# EAGLE design magic (EAGLE 9.5.2)

## Sheet 1 of 2
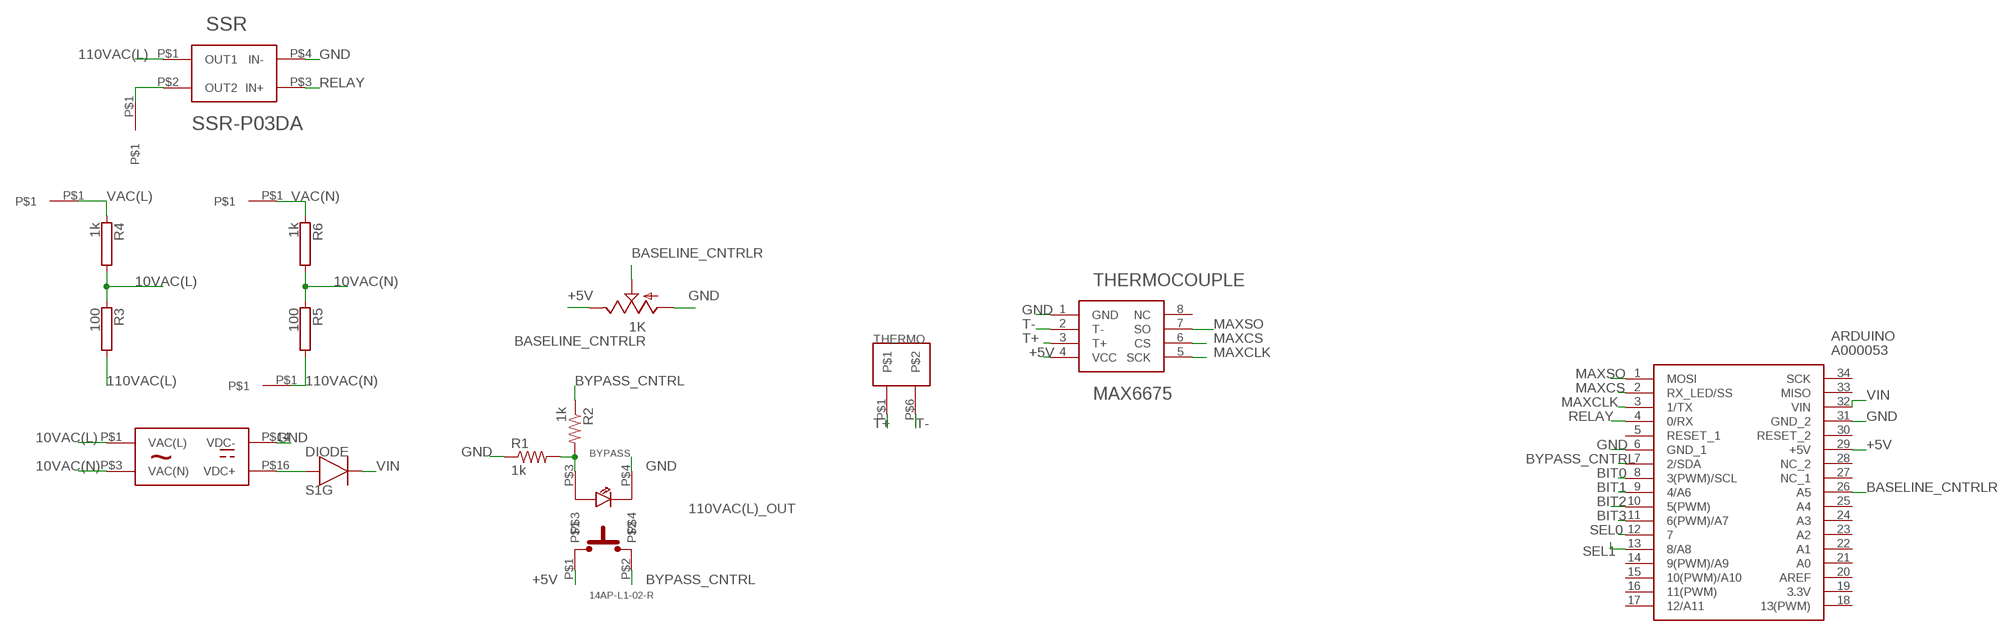
[diagram p0: schematic, sheet 1]

### Parts
110VAC(L)_OUT  6-GAUGE  [6-GAUGE]
110VAC(N)_OUT  6-GAUGE  [6-GAUGE]
AC(L)_IN  6-GAUGE  [6-GAUGE]
AC(N)_IN  6-GAUGE  [6-GAUGE]
ARDUINO  A000053  [HDRV34W70P1570X254_2X17_4900X1]
BASELINE_CNTRLR  1K  TRIM_US-PT10  [PT-10]
BYPASS  14AP-L1-02-R  [14XX-LX-0X-X]
DIODE  S1G  [S1G]
R1  1k  R-US_M1206  [M1206]
R2  1k  R-US_M1206  [M1206]
R3  100  RMG100-V  [TO-247-2V]
R4  1k  RMG100-V  [TO-247-2V]
R5  100  RMG100-V  [TO-247-2V]
R6  1k  RMG100-V  [TO-247-2V]
SSR  SSR-P03DA  [SSR-P03DA]
THERMO  PC6-16/2-G1-10,16  [PC6-16/2-G1-10,16]
THERMOCOUPLE  MAX6675  [MAX6675]
TRANSFORMER  RAC04-09SC  [RAC04-09SC]

### Nets
10VAC(L): R3.1 R4.2 TRANSFORMER.P$1(VAC(L))
10VAC(N): R5.1 R6.2 TRANSFORMER.P$3(VAC(N))
110VAC(L): R3.2 SSR.P$1(OUT1)
110VAC(L)_OUT: 110VAC(L)_OUT.P$1 SSR.P$2(OUT2)
110VAC(N): 110VAC(N)_OUT.P$1 R5.2
+5V: ARDUINO.29(+5V) BASELINE_CNTRLR.E BYPASS.P$1 THERMOCOUPLE.4(VCC) ; also sheet 2
BASELINE_CNTRLR: ARDUINO.26(A5) BASELINE_CNTRLR.S
BIT0: ARDUINO.8(3(PWM)/SCL) ; also sheet 2
BIT1: ARDUINO.9(4/A6) ; also sheet 2
BIT2: ARDUINO.10(5(PWM)) ; also sheet 2
BIT3: ARDUINO.11(6(PWM)/A7) ; also sheet 2
BYPASS_CNTRL: ARDUINO.7(2/SDA) BYPASS.P$2 R2.1
GND: ARDUINO.6(GND_1) ARDUINO.31(GND_2) BASELINE_CNTRLR.A BYPASS.P$4 R1.1 SSR.P$4(IN-) THERMOCOUPLE.1(GND) TRANSFORMER.P$14(VDC-) ; also sheet 2
MAXCLK: ARDUINO.3(1/TX) THERMOCOUPLE.5(SCK)
MAXCS: ARDUINO.2(RX_LED/SS) THERMOCOUPLE.6(CS)
MAXSO: ARDUINO.1(MOSI) THERMOCOUPLE.7(SO)
N$1: DIODE.2 TRANSFORMER.P$16(VDC+)
N$2: BYPASS.P$3 R1.2 R2.2
RELAY: ARDUINO.4(0/RX) SSR.P$3(IN+)
SEL0: ARDUINO.12 ; also sheet 2
SEL1: ARDUINO.13(8/A8) ; also sheet 2
T+: THERMO.P$1 THERMOCOUPLE.3(T+)
T-: THERMO.P$6 THERMOCOUPLE.2(T-)
VAC(L): AC(L)_IN.P$1 R4.1
VAC(N): AC(N)_IN.P$1 R6.1
VIN: ARDUINO.32(VIN) DIODE.1
Unconnected: ARDUINO.5(RESET_1) ARDUINO.14(9(PWM)/A9) ARDUINO.15(10(PWM)/A10) ARDUINO.16(11(PWM)) ARDUINO.17(12/A11) ARDUINO.18(13(PWM)) ARDUINO.19(3.3V) ARDUINO.20(AREF) ARDUINO.21(A0) ARDUINO.22(A1) ARDUINO.23(A2) ARDUINO.24(A3) ARDUINO.25(A4) ARDUINO.27(NC_1) ARDUINO.28(NC_2) ARDUINO.30(RESET_2) ARDUINO.33(MISO) ARDUINO.34(SCK) THERMOCOUPLE.8(NC)

## Sheet 2 of 2
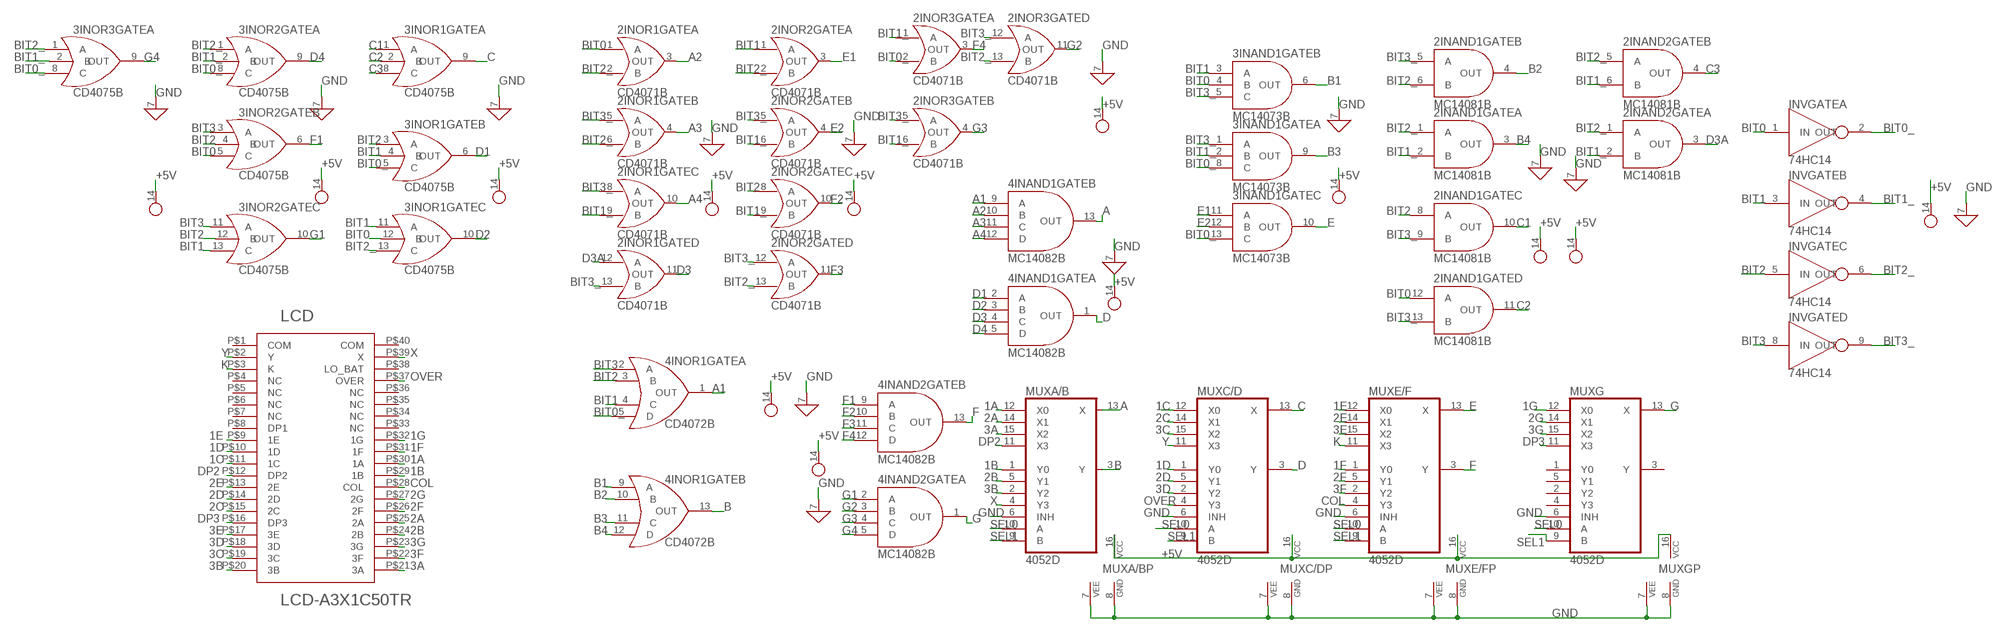
[diagram p1: schematic, sheet 2]

### Parts
2INAND1  MC14081B  [MC140XXBG]
2INAND2  MC14081B  [MC140XXBG]
2INOR1  CD4071B  [CD407XB]
2INOR2  CD4071B  [CD407XB]
2INOR3  CD4071B  [CD407XB]
3INAND1  MC14073B  [MC140XXBG]
3INOR1  CD4075B  [CD407XB]
3INOR2  CD4075B  [CD407XB]
3INOR3  CD4075B  [CD407XB]
4INAND1  MC14082B  [MC140XXBG]
4INAND2  MC14082B  [MC140XXBG]
4INOR1  CD4072B  [CD407XB]
INV  74HC14  [74HC14]
LCD  LCD-A3X1C50TR  [LCD-A3X1C50TR]
MUXA/B  4052D  [SO16]
MUXC/D  4052D  [SO16]
MUXE/F  4052D  [SO16]
MUXG  4052D  [SO16]

### Nets
1A: LCD.P$30(1A) MUXA/B.12(X0)
1B: LCD.P$29(1B) MUXA/B.1(Y0)
1C: LCD.P$11(1C) MUXC/D.12(X0)
1D: LCD.P$10(1D) MUXC/D.1(Y0)
1E: LCD.P$9(1E) MUXE/F.12(X0)
1F: LCD.P$31(1F) MUXE/F.1(Y0)
1G: LCD.P$32(1G) MUXG.12(X0)
2A: LCD.P$25(2A) MUXA/B.14(X1)
2B: LCD.P$24(2B) MUXA/B.5(Y1)
2C: LCD.P$15(2C) MUXC/D.14(X1)
2D: LCD.P$14(2D) MUXC/D.5(Y1)
2E: LCD.P$13(2E) MUXE/F.14(X1)
2F: LCD.P$26(2F) MUXE/F.5(Y1)
2G: LCD.P$27(2G) MUXG.14(X1)
3A: LCD.P$21(3A) MUXA/B.15(X2)
3B: LCD.P$20(3B) MUXA/B.2(Y2)
3C: LCD.P$19(3C) MUXC/D.15(X2)
3D: LCD.P$18(3D) MUXC/D.2(Y2)
3E: LCD.P$17(3E) MUXE/F.15(X2)
3F: LCD.P$22(3F) MUXE/F.2(Y2)
3G: LCD.P$23(3G) MUXG.15(X2)
+5V: 2INAND1.14 2INAND2.14 2INOR1.14 2INOR2.14 2INOR3.14 3INAND1.14 3INOR1.14 3INOR2.14 3INOR3.14 4INAND1.14 4INAND2.14 4INOR1.14 INV.14 MUXA/B.16(VCC) MUXC/D.16(VCC) MUXE/F.16(VCC) MUXG.16(VCC) ; also sheet 1
A: 4INAND1.13(GATEB:OUT) MUXA/B.13(X)
A1: 4INAND1.9(GATEB:A) 4INOR1.1(GATEA:OUT)
A2: 2INOR1.3(GATEA:OUT) 4INAND1.10(GATEB:B)
A3: 2INOR1.4(GATEB:OUT) 4INAND1.11(GATEB:C)
A4: 2INOR1.10(GATEC:OUT) 4INAND1.12(GATEB:D)
B: 4INOR1.13(GATEB:OUT) MUXA/B.3(Y)
B1: 3INAND1.6(GATEB:OUT) 4INOR1.9(GATEB:A)
B2: 2INAND1.4(GATEB:OUT) 4INOR1.10(GATEB:B)
B3: 3INAND1.9(GATEA:OUT) 4INOR1.11(GATEB:C)
B4: 2INAND1.3(GATEA:OUT) 4INOR1.12(GATEB:D)
BIT0: 2INAND1.12(GATED:A) 2INOR1.1(GATEA:A) 3INAND1.4(GATEB:B) 3INOR1.12(GATEC:B) 3INOR2.5(GATEB:C) INV.1(IN) ; also sheet 1
BIT0_: 2INOR3.2(GATEA:B) 3INAND1.8(GATEA:C) 3INAND1.13(GATEC:C) 3INOR1.5(GATEB:C) 3INOR2.8(GATEA:C) 3INOR3.8(GATEA:C) 4INOR1.5(GATEA:D) INV.2(OUT)
BIT1: 2INOR2.1(GATEA:A) 3INAND1.3(GATEB:A) 3INOR1.4(GATEB:B) 3INOR1.11(GATEC:A) 3INOR2.13(GATEC:C) 4INOR1.4(GATEA:C) INV.3(IN) ; also sheet 1
BIT1_: 2INAND1.2(GATEA:B) 2INAND2.2(GATEA:B) 2INAND2.6(GATEB:B) 2INOR1.9(GATEC:B) 2INOR2.6(GATEB:B) 2INOR2.9(GATEC:B) 2INOR3.1(GATEA:A) 2INOR3.6(GATEB:B) 3INAND1.2(GATEA:B) 3INOR2.2(GATEA:B) 3INOR3.2(GATEA:B) INV.4(OUT)
BIT2: 2INAND1.8(GATEC:A) 2INOR2.8(GATEC:A) 3INOR1.3(GATEB:A) 3INOR2.4(GATEB:B) 3INOR2.12(GATEC:B) 4INOR1.3(GATEA:B) INV.5(IN) ; also sheet 1
BIT2_: 2INAND1.1(GATEA:A) 2INAND1.6(GATEB:B) 2INAND2.1(GATEA:A) 2INAND2.5(GATEB:A) 2INOR1.2(GATEA:B) 2INOR1.6(GATEB:B) 2INOR2.2(GATEA:B) 2INOR2.13(GATED:B) 2INOR3.13(GATED:B) 3INOR1.13(GATEC:C) 3INOR2.1(GATEA:A) 3INOR3.1(GATEA:A) INV.6(OUT)
BIT3: 3INOR2.3(GATEB:A) 3INOR2.11(GATEC:A) 4INOR1.2(GATEA:A) INV.8(IN) ; also sheet 1
BIT3_: 2INAND1.5(GATEB:A) 2INAND1.9(GATEC:B) 2INAND1.13(GATED:B) 2INOR1.5(GATEB:A) 2INOR1.8(GATEC:A) 2INOR1.13(GATED:B) 2INOR2.5(GATEB:A) 2INOR2.12(GATED:A) 2INOR3.5(GATEB:A) 2INOR3.12(GATED:A) 3INAND1.1(GATEA:A) 3INAND1.5(GATEB:C) INV.9(OUT)
C: 3INOR1.9(GATEA:OUT) MUXC/D.13(X)
C1: 2INAND1.10(GATEC:OUT) 3INOR1.1(GATEA:A)
C2: 2INAND1.11(GATED:OUT) 3INOR1.2(GATEA:B)
C3: 2INAND2.4(GATEB:OUT) 3INOR1.8(GATEA:C)
COL: LCD.P$28(COL) MUXE/F.4(Y3)
D: 4INAND1.1(GATEA:OUT) MUXC/D.3(Y)
D1: 3INOR1.6(GATEB:OUT) 4INAND1.2(GATEA:A)
D2: 3INOR1.10(GATEC:OUT) 4INAND1.3(GATEA:B)
D3: 2INOR1.11(GATED:OUT) 4INAND1.4(GATEA:C)
D3A: 2INAND2.3(GATEA:OUT) 2INOR1.12(GATED:A)
D4: 3INOR2.9(GATEA:OUT) 4INAND1.5(GATEA:D)
DP2: LCD.P$12(DP2) MUXA/B.11(X3)
DP3: LCD.P$16(DP3) MUXG.11(X3)
E: 3INAND1.10(GATEC:OUT) MUXE/F.13(X)
E1: 2INOR2.3(GATEA:OUT) 3INAND1.11(GATEC:A)
E2: 2INOR2.4(GATEB:OUT) 3INAND1.12(GATEC:B)
F: 4INAND2.13(GATEB:OUT) MUXE/F.3(Y)
F1: 3INOR2.6(GATEB:OUT) 4INAND2.9(GATEB:A)
F2: 2INOR2.10(GATEC:OUT) 4INAND2.10(GATEB:B)
F3: 2INOR2.11(GATED:OUT) 4INAND2.11(GATEB:C)
F4: 2INOR3.3(GATEA:OUT) 4INAND2.12(GATEB:D)
G: 4INAND2.1(GATEA:OUT) MUXG.13(X)
G1: 3INOR2.10(GATEC:OUT) 4INAND2.2(GATEA:A)
G2: 2INOR3.11(GATED:OUT) 4INAND2.3(GATEA:B)
G3: 2INOR3.4(GATEB:OUT) 4INAND2.4(GATEA:C)
G4: 3INOR3.9(GATEA:OUT) 4INAND2.5(GATEA:D)
GND: 2INAND1.7 2INAND2.7 2INOR1.7 2INOR2.7 2INOR3.7 3INAND1.7 3INOR1.7 3INOR2.7 3INOR3.7 4INAND1.7 4INAND2.7 4INOR1.7 INV.7 MUXA/B.6(INH) MUXA/B.7(VEE) MUXA/B.8(GND) MUXC/D.6(INH) MUXC/D.7(VEE) MUXC/D.8(GND) MUXE/F.6(INH) MUXE/F.7(VEE) MUXE/F.8(GND) MUXG.6(INH) MUXG.7(VEE) MUXG.8(GND) ; also sheet 1
K: LCD.P$3(K) MUXE/F.11(X3)
OVER: LCD.P$37(OVER) MUXC/D.4(Y3)
SEL0: MUXA/B.10(A) MUXC/D.10(A) MUXE/F.10(A) MUXG.10(A) ; also sheet 1
SEL1: MUXA/B.9(B) MUXC/D.9(B) MUXE/F.9(B) MUXG.9(B) ; also sheet 1
X: LCD.P$39(X) MUXA/B.4(Y3)
Y: LCD.P$2(Y) MUXC/D.11(X3)
Unconnected: 2INAND2.8(GATEC:A) 2INAND2.9(GATEC:B) 2INAND2.10(GATEC:OUT) 2INAND2.11(GATED:OUT) 2INAND2.12(GATED:A) 2INAND2.13(GATED:B) 2INOR3.8(GATEC:A) 2INOR3.9(GATEC:B) 2INOR3.10(GATEC:OUT) 3INOR3.3(GATEB:A) 3INOR3.4(GATEB:B) 3INOR3.5(GATEB:C) 3INOR3.6(GATEB:OUT) 3INOR3.10(GATEC:OUT) 3INOR3.11(GATEC:A) 3INOR3.12(GATEC:B) 3INOR3.13(GATEC:C) INV.10(IN) INV.11(OUT) INV.12(IN) INV.13(OUT) LCD.P$1(COM) LCD.P$4(NC) LCD.P$5(NC) LCD.P$6(NC) LCD.P$7(NC) LCD.P$8(DP1) LCD.P$33(NC) LCD.P$34(NC) LCD.P$35(NC) LCD.P$36(NC) LCD.P$38(LO_BAT) LCD.P$40(COM) MUXG.1(Y0) MUXG.2(Y2) MUXG.3(Y) MUXG.4(Y3) MUXG.5(Y1)

## Library data of the parts
2INAND1 2INAND2 = magic:MC14081B
2INOR1-2INOR3 = magic:CD4071B
3INAND1 = magic:MC14073B
3INOR1-3INOR3 = magic:CD4075B
4INAND1 4INAND2 = magic:MC14082B
4INOR1 = magic:CD4072B
110VAC(L)_OUT 110VAC(N)_OUT AC(L)_IN AC(N)_IN = magic:6-GAUGE
ARDUINO = A000053:A000053: Arduino Micro Arduino Micro Source: Datasheet <http://uk.rs-online.com/web/p/products/7717667>; DESCRIPTION: Arduino Micro Arduino Micro; HEIGHT: 16mm; MANUFACTURER_NAME: Arduino; MANUFACTURER_PART_NUMBER: A000053; MOUSER_PART_NUMBER: 782-A000053; MOUSER_PRICE-STOCK: https://www.mouser.com/Search/Refine.aspx?Keyword=782-A000053; RS_PART_NUMBER: 7717667; RS_PRICE-STOCK: http://uk.rs-online.com/web/p/products/7717667
BASELINE_CNTRLR = pot:TRIM_US-: POTENTIOMETER
BYPASS = magic:14AP-L1-02-R
DIODE = magic:S1G
INV = magic:74HC14
LCD = magic:LCD-A3X1C50TR
MUXA/B MUXC/D MUXE/F MUXG = 40xx:4052: Dual 4-channel ANALOG MULTIPLEXER
R1 R2 = rcl:R-US_: RESISTOR, American symbol; SPICEPREFIX: R
R3-R6 = resistor-power:RMG100: TO-247 Power Resistor - RMG 100 Series Source: www.token.com.tw .. power-resistor-rmg100pdf; OC_FARNELL: unknown; OC_NEWARK: unknown
SSR = magic:SSR-P03DA
THERMO = magic:PC6-16/2-G1-10,16
THERMOCOUPLE = magic:MAX6675
TRANSFORMER = magic:RAC04-09SC

## Board
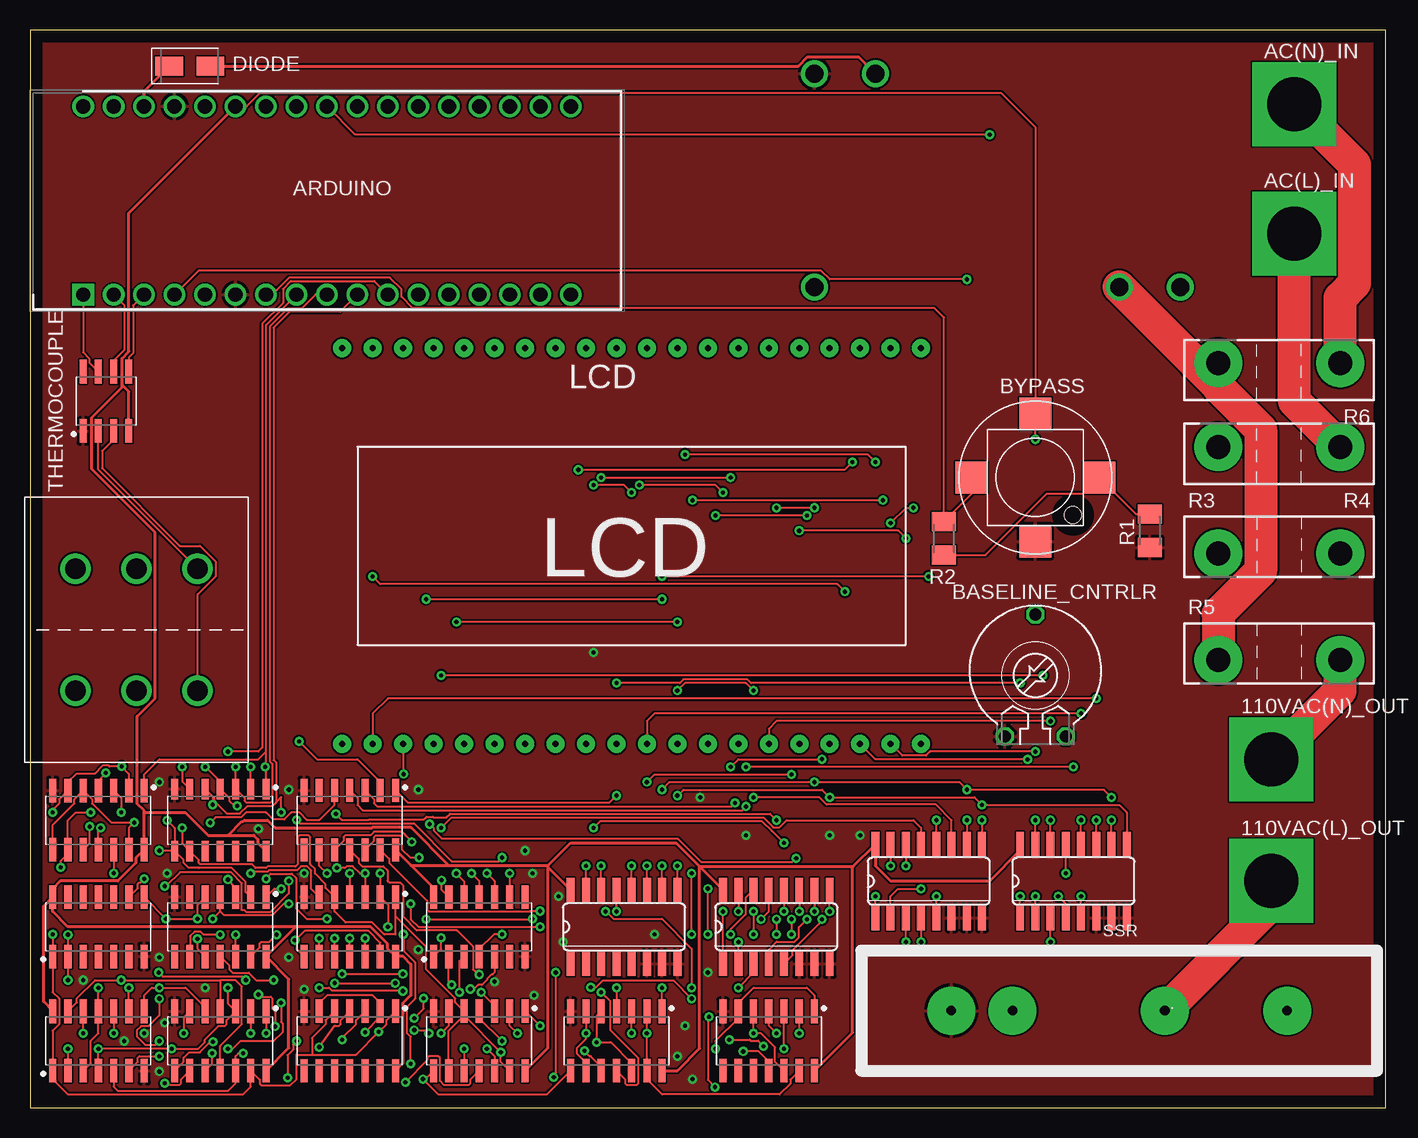
[diagram p2: board, top side]
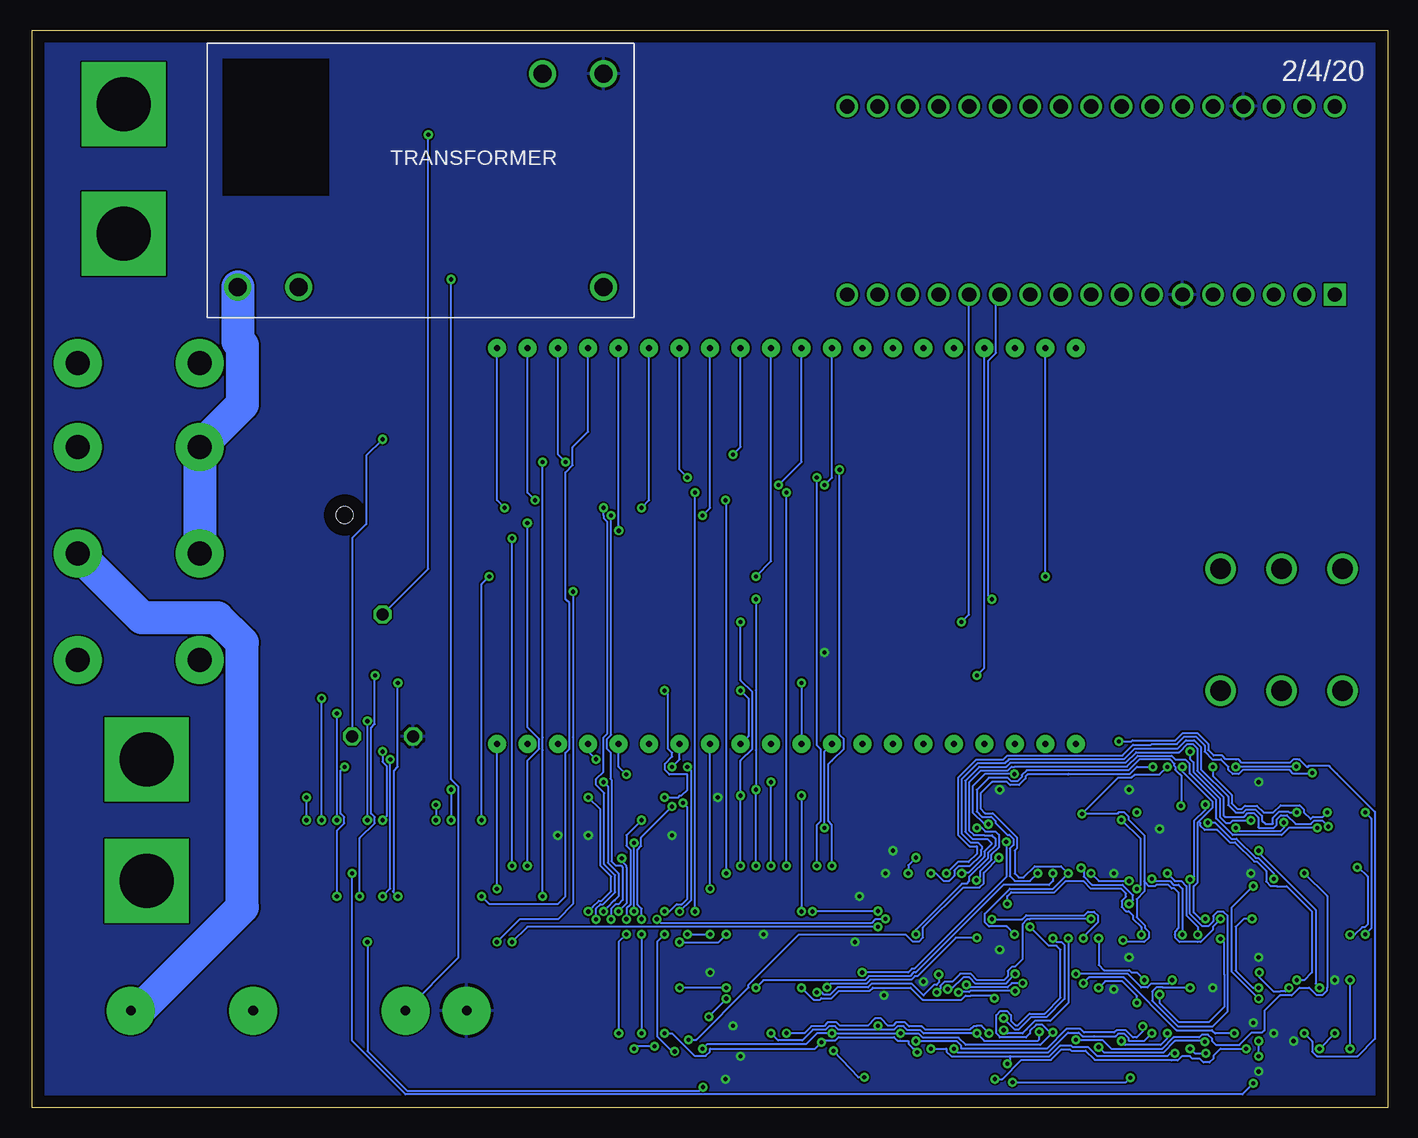
[diagram p3: board, bottom side, seen from below]

Size 113.01 x 89.84 mm. Coordinates in mm from the lower left corner, seen from the top.
Outline: 0,0 113.01,0 113.01,89.84 0,89.84 0,0
Copper layers (1*16): Top 0.035mm / dielectric 1.5mm / Bottom 0.035mm
Design rules "default *": minimum track width 6mil, minimum drill 0.35mm, track to track 6mil, track to pad 6mil, pad to pad 6mil, via to via 6mil, smd to smd 6mil, copper to edge 40mil, drill to drill 6mil, minimum pad ring 10mil, minimum via ring 8mil, stop-mask expansion 4mil, vias tented up to drill 0mil, thermal gap 10mil

### Footprints (pad centres in the part's own frame; a part is rotated, then mirrored left to right if it is on the bottom)
MC140XXBG = smd 1.952 x 0.589: 1 -2.482,3.81; 2 -2.482,2.54; 3 -2.482,1.27; 4 -2.482,0; 5 -2.482,-1.27; 6 -2.482,-2.54; 7 -2.482,-3.81; 8 2.482,-3.81; 9 2.482,-2.54; 10 2.482,-1.27; 11 2.482,0; 12 2.482,1.27; 13 2.482,2.54; 14 2.482,3.81
CD407XB = smd 1.968 x 0.599: 1 -2.473,3.81; 2 -2.473,2.54; 3 -2.473,1.27; 4 -2.473,0; 5 -2.473,-1.27; 6 -2.473,-2.54; 7 -2.473,-3.81; 8 2.473,-3.81; 9 2.473,-2.54; 10 2.473,-1.27; 11 2.473,0; 12 2.473,1.27; 13 2.473,2.54; 14 2.473,3.81
6-GAUGE = drill 4.5 pad 7 square: P$1 0,0
HDRV34W70P1570X254_2X17_4900X1 = drill 1.2 pad 1.8 square: 1 0,0 | drill 1.2 pad 1.8: 2 2.54,0; 3 5.08,0; 4 7.62,0; 5 10.16,0; 6 12.7,0; 7 15.24,0; 8 17.78,0; 9 20.32,0; 10 22.86,0; 11 25.4,0; 12 27.94,0; 13 30.48,0; 14 33.02,0; 15 35.56,0; 16 38.1,0; 17 40.64,0; 18 40.64,15.7; 19 38.1,15.7; 20 35.56,15.7; 21 33.02,15.7; 22 30.48,15.7; 23 27.94,15.7; 24 25.4,15.7; 25 22.86,15.7; 26 20.32,15.7; 27 17.78,15.7; 28 15.24,15.7; 29 12.7,15.7; 30 10.16,15.7; 31 7.62,15.7; 32 5.08,15.7; 33 2.54,15.7; 34 0,15.7
PT-10 = drill 1.016 octagon: A -2.54,-5.08; E 2.54,-5.08; S 0,5.08
14XX-LX-0X-X = smd 2.67 x 2.67: P$1 0,5.325; P$2 -5.325,0; P$3 5.325,0; P$4 0,-5.325 | hole 1.4: 3.147,-3.147
S1G = smd 2.31 x 1.564: 1 -1.724,0; 2 1.724,0
74HC14 = smd 1.746 x 0.592: 1 -2.585,3.81; 2 -2.585,2.54; 3 -2.585,1.27; 4 -2.585,0; 5 -2.585,-1.27; 6 -2.585,-2.54; 7 -2.585,-3.81; 8 2.585,-3.81; 9 2.585,-2.54; 10 2.585,-1.27; 11 2.585,0; 12 2.585,1.27; 13 2.585,2.54; 14 2.585,3.81
LCD-A3X1C50TR = drill 0.5 pad 1.5: P$1 -24.13,-16.5; P$2 -21.59,-16.5; P$3 -19.05,-16.5; P$4 -16.51,-16.5; P$5 -13.97,-16.5; P$6 -11.43,-16.5; P$7 -8.89,-16.5; P$8 -6.35,-16.5; P$9 -3.81,-16.5; P$10 -1.27,-16.5; P$11 1.27,-16.5; P$12 3.81,-16.5; P$13 6.35,-16.5; P$14 8.89,-16.5; P$15 11.43,-16.5; P$16 13.97,-16.5; P$17 16.51,-16.5; P$18 19.05,-16.5; P$19 21.59,-16.5; P$20 24.13,-16.5; P$21 24.13,16.5; P$22 21.59,16.5; P$23 19.05,16.5; P$24 16.51,16.5; P$25 13.97,16.5; P$26 11.43,16.5; P$27 8.89,16.5; P$28 6.35,16.5; P$29 3.81,16.5; P$30 1.27,16.5; P$31 -1.27,16.5; P$32 -3.81,16.5; P$33 -6.35,16.5; P$34 -8.89,16.5; P$35 -11.43,16.5; P$36 -13.97,16.5; P$37 -16.51,16.5; P$38 -19.05,16.5; P$39 -21.59,16.5; P$40 -24.13,16.5
SO16 = smd 0.66 x 2.032: 1 -4.445,-3.073; 2 -3.175,-3.073; 3 -1.905,-3.073; 4 -0.635,-3.073; 5 0.635,-3.073; 6 1.905,-3.073; 7 3.175,-3.073; 8 4.445,-3.073; 9 4.445,3.073; 10 3.175,3.073; 11 1.905,3.073; 12 0.635,3.073; 13 -0.635,3.073; 14 -1.905,3.073; 15 -3.175,3.073; 16 -4.445,3.073
M1206 = smd 1.6 x 2: 1 -1.4,0; 2 1.4,0
TO-247-2V = drill 2 pad 4: 1 -5.08,0; 2 5.08,0
SSR-P03DA = drill 0.8 pad 4: P$1 10.2,0; P$2 0,0; P$3 -12.7,0; P$4 -17.8,0
PC6-16/2-G1-10,16 = drill 1.7: P$1 0,0; P$2 0,5.08; P$3 0,10.16; P$4 10.16,10.16; P$5 10.16,5.08; P$6 10.16,0
MAX6675 = smd 1.968 x 0.589: 1 -2.473,1.905; 2 -2.473,0.635; 3 -2.473,-0.635; 4 -2.473,-1.905; 5 2.473,-1.905; 6 2.473,-0.635; 7 2.473,0.635; 8 2.473,1.905
RAC04-09SC = drill 1.5: P$1 0,0; P$3 5.08,0; P$13 30.48,0; P$14 30.48,17.78; P$16 25.4,17.78

### Placement (x,y rotation side)
2INAND1  37.45,5.55 270 top
2INAND2  26.66,5.55 270 top
2INOR1  5.7,23.96 270 top
2INOR2  48.88,5.55 270 top
2INOR3  61.59,5.55 270 top
3INAND1  26.66,15.08 270 top
3INOR1  15.87,5.55 270 top
3INOR2  5.7,5.55 90 top
3INOR3  5.7,15.08 90 top
4INAND1  37.45,15.08 90 top
4INAND2  26.66,23.96 270 top
4INOR1  15.87,15.08 270 top
110VAC(L)_OUT  103.5,18.89 0 top
110VAC(N)_OUT  103.5,29.05 0 top
AC(L)_IN  105.4,72.86 0 top
AC(N)_IN  105.4,83.66 0 top
ARDUINO  4.44,67.78 0 top
BASELINE_CNTRLR  83.81,36.03 0 top
BYPASS  83.81,52.54 0 top
DIODE  13.33,86.83 0 top
INV  15.87,23.96 270 top
LCD  50.16,46.83 0 top
MUXA/B  74.92,18.89 0 top
MUXC/D  86.98,18.89 0 top
MUXE/F  62.22,15.08 0 top
MUXG  49.52,15.08 0 top
R1  93.34,48.09 90 top
R2  76.19,47.46 270 top
R3  104.13,46.19 0 top
R4  104.13,55.08 180 top
R5  104.13,37.3 0 top
R6  104.13,62.06 180 top
SSR  94.6,8.09 0 top
THERMO  13.96,34.76 90 top
THERMOCOUPLE  6.34,58.89 90 top
TRANSFORMER  95.88,68.41 0 bottom

### Tracks (layer width: path | path; a pad name or v marks a point on that pad's centre or on a via)
1A  (via drill 0.35)
  Top 0.152: MUXA/B.12 v75.56,23.96 | v74.92,44.29 v52.7,44.29
  Bottom 0.152: v75.56,23.96 75.56,43.65 v74.92,44.29 | LCD.P$30 51.42,45.55 v52.7,44.29
1B  (via drill 0.35)
  Top 0.152: MUXA/B.1 v70.47,17.62 | v70.47,53.81 69.84,54.45 v54.6,54.45
  Bottom 0.152: v70.47,17.62 70.47,29.78 70.46,29.79 70.46,30.86 70.47,30.87 v70.47,53.81 | v54.6,54.45 53.97,55.08 LCD.P$29
1C  (via drill 0.35)
  Top 0.152: MUXC/D.12 v87.62,23.96 | v87.62,32.86 52.06,32.86 51.42,32.22 LCD.P$11
  Bottom 0.152: v87.62,23.96 v87.62,32.86
1D  (via drill 0.35)
  Top 0.152: MUXC/D.1 v82.54,17.62 | v82.54,35.4 60.11,35.4 59.81,35.7 54.47,35.7 54.17,35.4 v48.88,35.4
  Bottom 0.152: v48.88,35.4 LCD.P$10 | v82.54,17.62 82.96,18.03 82.86,18.13 82.86,28.09 82.54,28.41 v82.54,35.4
1E  (via drill 0.35)
  Top 0.152: MUXE/F.12 v62.86,16.36 | v62.86,22.06 61.86,23.05 61.84,23.05 61.02,23.88 47.53,23.88 v46.98,23.33
  Bottom 0.152: v62.86,16.36 v62.86,22.06 | v46.98,23.33 46.98,29.69 LCD.P$9
1F  (via drill 0.35)
  Top 0.152: MUXE/F.1 v57.77,16.35 | v57.77,51.27 57.13,51.91 v50.8,51.91
  Bottom 0.152: v57.77,16.35 v57.77,51.27 | v50.8,51.91 48.88,53.83 LCD.P$31
1G  (via drill 0.35)
  Top 0.152: MUXG.12 v50.16,20.16 | v50.16,51.27 49.52,51.91 v46.98,51.91 v46.97,51.9
  Bottom 0.152: v50.16,20.16 v50.16,51.27 | v46.97,51.9 46.34,52.52 LCD.P$32
2A  (via drill 0.35)
  Top 0.152: MUXA/B.14 v73.02,20.16 | v73.02,47.46 72.38,48.09 v64.12,48.09
  Bottom 0.152: v73.02,20.16 v73.02,47.46 | v64.12,48.09 LCD.P$25
2B  (via drill 0.35)
  Top 0.152: MUXA/B.5 v75.56,17.62
  Bottom 0.152: v75.56,17.62 74.92,16.98 69.2,16.98 68.57,17.62 68.57,29.58 68.23,29.92 68.23,30.73 68.24,30.74 68.24,42.05 68.57,42.38 68.57,52.95 67.96,53.56 67.96,55.05 66.66,56.35 LCD.P$24
2C  (via drill 0.35)
  Top 0.152: MUXC/D.14 v85.08,23.96 | v85.08,32.22 62.22,32.22 61.59,31.59 LCD.P$15
  Bottom 0.152: v85.08,23.96 v85.08,32.22
2D  (via drill 0.35)
  Top 0.152: MUXC/D.5 v87.62,17.62 | v86.98,28.41 v59.68,28.41
  Bottom 0.152: v87.62,17.62 87.62,23.11 87.01,23.71 87.01,24.22 87.31,24.52 87.31,28.08 v86.98,28.41 | v59.68,28.41 59.05,29.05 LCD.P$14
2E  (via drill 0.35)
  Top 0.152: MUXE/F.14 59.65,17.48 59.65,16.09 58.41,14.85 v58.41,14.44 | v56.51,14.44 v56.51,18.25
  Bottom 0.152: v58.41,14.44 v56.51,14.44 | v56.51,18.25 LCD.P$13
2F  (via drill 0.35)
  Top 0.152: MUXE/F.5 63.57,12.71 63.57,13.11 66.03,15.58 v66.03,15.7 | v65.4,50.01 v65.39,50 v62.22,50
  Bottom 0.152: v62.22,50 61.59,50.63 LCD.P$26 | v66.03,15.7 66,15.72 66,16.6 65.65,16.95 65.42,16.95 64.43,17.95 64.43,19.38 65.34,20.29 65.34,26.23 66,26.89 66,27.39 65.39,28 65.39,29.78 65.41,29.79 65.41,30.86 65.06,31.2 65.06,48.81 65.37,49.11 65.37,49.34 65.4,49.37 v65.4,50.01
2G  (via drill 0.35)
  Top 0.152: MUXG.14 v47.62,20.16 | v47.62,52.54 v58.41,52.54
  Bottom 0.152: v58.41,52.54 59.05,53.17 LCD.P$27 | v47.62,20.16 47.59,20.18 47.59,23.58 47.28,23.88 47.28,29.88 47.59,30.18 47.59,52.51 v47.62,52.54
3A  (via drill 0.35)
  Top 0.152: MUXA/B.15 v71.75,20.16 | v71.75,48.73 73.02,50 v73.65,50
  Bottom 0.152: v71.75,20.16 71.75,28.94 70.77,29.92 70.77,30.73 71.75,31.71 v71.75,48.73 | v73.65,50 74.28,50.63 LCD.P$21
3B  (via drill 0.35)
  Top 0.152: MUXA/B.2 71.75,17.62 72.36,18.23 v74.28,18.23
  Bottom 0.152: v74.28,18.23 LCD.P$20
3C  (via drill 0.35)
  Top 0.152: MUXC/D.15 v83.81,23.96 | v83.81,29.68 75.02,29.68 74.69,29.35 72.72,29.35 LCD.P$19
  Bottom 0.152: v83.81,29.68 83.81,28.82 83.47,28.48 83.47,24.3 v83.81,23.96
3D  (via drill 0.35)
  Top 0.152: MUXC/D.2 v83.81,17.62 | v83.17,29.04 70.49,29.04 LCD.P$18
  Bottom 0.152: v83.81,17.62 83.17,18.26 v83.17,29.04
3E  (via drill 0.35)
  Top 0.152: MUXE/F.15 v59.05,16.35 | v58.41,28.41 59.05,29.05 v66.03,29.05
  Bottom 0.152: v66.03,29.05 66.66,29.68 LCD.P$17 | v59.05,16.35 58.08,17.31 58.08,28.08 v58.41,28.41
3F  (via drill 0.35)
  Top 0.152: MUXE/F.2 v59.05,13.79 v59.05,13.8 | v55.16,14.44 v55.16,19.52 | v55.23,50.63 v71.11,50.63
  Bottom 0.152: v59.05,13.8 55.8,13.8 v55.16,14.44 | v55.16,19.52 55.16,50.56 v55.23,50.63 | v71.11,50.63 71.75,51.27 LCD.P$22
3G  (via drill 0.35)
  Top 0.152: MUXG.15 v46.34,20.16 | v45.71,53.17 67.94,53.17 v68.57,53.81
  Bottom 0.152: v45.71,53.17 45.71,31.07 45.37,30.73 45.37,29.92 46.29,28.99 46.34,28.94 46.67,28.61 46.67,23.88 46.37,23.58 46.37,20.18 v46.34,20.16 | v68.57,53.81 69.2,54.45 LCD.P$23
10VAC(L)
  Bottom 2.769: TRANSFORMER.P$1 95.88,63.89 95.51,63.53 95.51,58.62 R4.2 R3.1
10VAC(N)
  Top 2.769: TRANSFORMER.P$3 97.15,62.06 | 97.15,62.06 R6.2 99.05,60.16 | R5.1 99.05,41.19 102.59,44.73 102.59,56.55 99.05,60.08 99.05,60.16 | 97.15,62.06 99.05,60.16
110VAC(L)
  Bottom 2.769: SSR.P$1 104.13,8.09 95.51,16.71 95.51,38.77 97.59,40.84 103.86,40.84 R3.2
110VAC(L)_OUT
  Top 2.769: SSR.P$2 103.5,16.98 110VAC(L)_OUT.P$1
110VAC(N)
  Top 2.769: 110VAC(N)_OUT.P$1 109.21,34.76 R5.2
+5V  (via drill 0.35)
  Top 0.152: ARDUINO.29 18.08,83.48 19.21,84.61 80.95,84.61 83.81,81.75 BYPASS.P$1 v83.81,55.72
  Top 0.254: ARDUINO.29 8.24,74.59 8.24,63.04 7.67,62.46 7.67,60.26 7.69,60.24 | THERMOCOUPLE.4 8.24,59.69 7.69,60.24 | 9.52,24.6 2INOR1.14 8.82,20.8 8.82,20.39 7.32,18.89 2.53,18.89 1.9,18.25 3INOR3.14 | 9.52,24.6 9.52,24.76 8.94,25.34 8.94,32.62 10.43,34.12 10.43,47.94 5.13,53.25 5.13,57.52 7.69,60.08 7.69,60.24 | INV.14 18.98,22.07 18.98,22.37 18.65,22.7 16.5,22.7 | 9.52,24.6 12.94,24.6 14.84,22.7 16.5,22.7 | 4INAND2.14 31.77,20.18 | 31.77,20.18 33.64,18.31 4INAND1.14 | 22.15,15.08 28.38,15.08 29.77,13.69 29.77,13.29 3INAND1.14 31.11,12.59 31.74,11.96 31.74,9.36 31.08,8.7 31.08,3.67 2INAND2.14 | 22.15,15.08 3.16,15.08 1.9,16.35 3INOR3.14 | 31.77,20.18 34.91,20.18 | 34.91,20.18 43.04,20.18 | 43.04,20.18 MUXG.16 | 43.04,20.18 43.17,20.18 | 55.82,20.1 MUXE/F.16 | 55.82,20.1 68.57,20.1 | 68.57,20.1 68.62,20.1 MUXA/B.16 70.47,20.16 71.75,18.89 80,18.89 82.54,21.43 MUXC/D.16 | 2INOR3.14 68.57,6.25 68.57,20.1 | 2INOR2.14 53.97,3.08 55.82,4.93 55.82,20.1 | 2INAND1.14 43.17,4.97 43.17,20.18 | 3INOR1.14 21.58,4.98 21.58,10.7 4INOR1.14 22.15,15.08 | 3INOR2.14 1.9,8.09 1.14,8.84 1.14,16.8 3INOR3.14 | 34.91,20.18 31.75,23.35 28.54,23.35 28.52,23.33 20.44,23.33 19.81,23.96 17.88,23.96 17.76,23.85 17.65,23.85 16.5,22.7 | 43.17,20.18 43.2,20.18 45.08,22.06 53.86,22.06 55.82,20.1
  Bottom 0.152: BASELINE_CNTRLR.E 86.35,47.47 85.16,48.65 85.16,54.36 v83.81,55.72
A  (via drill 0.35)
  Top 0.152: 4INAND1.13 34.31,18.16 v34.31,18.96 | MUXA/B.13 74.28,23.33 73.65,23.96 63.08,23.96 62.47,23.36 61.97,23.36 61.14,24.18 35.13,24.18 v34.28,23.33
  Bottom 0.152: v34.31,18.96 34.28,18.94 34.01,19.22 34.01,19.7 33.04,20.67 33.04,21.09 32.43,21.7 32.43,22.75 32.71,23.03 33.56,23.03 33.87,23.33 v34.28,23.33
A1  (via drill 0.35)
  Top 0.152: 4INOR1.1 20.37,18.24 v20.94,18.24 | v39.99,19.52 4INAND1.9 | v22.21,23.99 22.52,23.69 28.37,23.69 28.39,23.7 32,23.7 35.16,20.54 39.06,20.54 v39.36,20.84
  Bottom 0.152: v39.36,20.84 39.99,20.21 v39.99,19.52 | v22.21,23.99 20.61,22.39 20.61,18.57 v20.94,18.24
A2  (via drill 0.35)
  Top 0.152: 2INOR1.3 7.61,25.8 v7.61,24.6 | v38.09,19.52 38.73,18.89 4INAND1.10
  Bottom 0.152: v38.09,19.52 37.68,19.52 37.07,18.91 36.57,18.91 36.15,19.34 36.15,19.76 35.79,20.12 34.88,20.12 33.95,21.05 33.95,21.47 33.82,21.6 33.82,21.76 34.15,22.09 34.76,22.09 35.54,22.87 35.54,27.37 34.2,28.72 31.94,28.72 31.62,29.04 22.01,29.04 21.12,29.93 17.54,29.93 16.85,30.62 16.15,30.62 15.59,30.06 15.59,28.2 13.33,25.94 13.33,25.23 12.69,24.6 12.05,24.6 11.8,24.85 11.04,24.85 10.51,24.32 10.51,23.96 10.18,23.64 9.64,23.64 9.59,23.69 9.59,24.14 9.06,24.68 8.3,24.68 8.23,24.6 v7.61,24.6
A3  (via drill 0.35)
  Top 0.152: 2INOR1.4 5.7,27.2 v6.31,27.9 | v36.82,19.52 37.45,18.89 4INAND1.11
  Bottom 0.152: v6.31,27.9 6.34,27.83 7.89,27.83 8.2,28.14 12.1,28.14 12.44,27.8 12.94,27.8 13.3,28.16 13.3,28.41 13.93,29.05 14.65,29.05 15.28,29.68 15.28,30.18 16.02,30.93 16.98,30.93 17.59,30.32 19.68,30.32 19.75,30.24 21.25,30.24 22.14,29.35 31.74,29.35 32.07,29.02 34.33,29.02 35.85,27.5 35.85,22.75 34.88,21.78 34.28,21.78 34.28,21.15 34.96,20.47 35.87,20.47 v36.82,19.52
A4  (via drill 0.35)
  Top 0.152: 2INOR1.10 4.97,22.03 v4.97,23.43 | v35.54,19.51 36.19,18.87 4INAND1.12
  Bottom 0.152: v4.97,23.43 5.48,23.94 6.13,23.94 6.43,23.64 7.69,23.64 8.43,24.37 8.93,24.37 9.28,24.02 9.28,23.56 9.52,23.33 10.78,23.33 10.81,23.36 10.81,24.19 11.17,24.55 11.67,24.55 11.98,24.24 13.6,24.24 13.71,24.35 13.71,25.89 15.89,28.07 15.89,29.93 16.28,30.32 16.72,30.32 17.41,29.63 21,29.63 21.88,28.74 31.49,28.74 31.81,28.41 34.07,28.41 35.24,27.25 35.24,23 34.63,22.39 33.37,22.39 33.04,22.06 33.04,21.95 33.65,21.35 33.65,20.92 34.98,19.59 35.46,19.59 v35.54,19.51
B  (via drill 0.35)
  Top 0.152: v20.56,14.42 19.96,13.81 19.28,13.81 19.15,13.68 19.15,13.34 4INOR1.13 | v31.74,16.98 31.74,15.71 32.38,15.08 v42.51,15.08 | v73.02,13.8 MUXA/B.3
  Bottom 0.152: v20.56,14.42 20.56,15.05 21.25,15.74 21.25,16.02 21.61,16.37 21.83,16.37 22.19,16.73 22.19,17.23 21.83,17.59 21.83,17.85 22.23,18.25 24.77,18.25 25.41,18.89 26.86,18.89 27.8,17.95 31.41,17.95 31.74,17.62 v31.74,16.98 | v42.51,15.08 71.75,15.08 v73.02,13.8
B1  (via drill 0.35)
  Top 0.152: 3INAND1.6 23.46,18.22 23.46,19.27 23.46,19.77 23.1,20.13 22.6,20.13 22.27,19.8 19.93,19.8 19.81,19.67 18.55,19.67 v18.41,19.52 | v15.87,14.42 14.46,14.42 14.21,14.67 13.71,14.67 13.35,14.31 13.35,12.63 4INOR1.9
  Bottom 0.152: v18.41,19.52 17.77,18.89 17.23,18.89 16.8,18.46 16.8,16.02 15.87,15.08 v15.87,14.42
B2  (via drill 0.35)
  Top 0.152: v13.96,14.06 13.96,13.24 4INOR1.10 | v20.45,6.76 20.45,8.01 20.2,8.26 20.2,9.1 20.07,9.24 19.23,9.24 v19.04,9.42 | v39.36,5.55 37.45,7.45 2INAND1.4
  Bottom 0.152: v39.36,5.55 39.33,5.52 35.93,5.52 35.58,5.17 35.58,4.94 35.55,4.91 28.44,4.91 26.8,6.56 25.65,6.56 25.35,6.26 22.82,6.26 22.61,6.46 21.86,6.46 21.25,5.86 20.95,5.86 20.45,6.35 v20.45,6.76 | v19.04,9.42 19.04,8.73 17.44,7.12 14.92,7.12 13.66,8.39 13.66,11.1 13.66,11.27 13.66,13.76 v13.96,14.06
B3  (via drill 0.35)
  Top 0.152: 4INOR1.11 16.61,11.86 16.61,11.52 16.89,11.24 18.24,11.24 18.85,10.63 v20.31,10.63 | 3INAND1.9 v24.12,14.11
  Bottom 0.152: v20.31,10.63 20.95,11.27 21.37,11.27 21.57,11.46 23.68,11.46 24.12,11.9 v24.12,14.11
B4  (via drill 0.35)
  Top 0.152: 4INOR1.12 v17.14,14.42 | v24.75,15.73 23.08,15.73 22.19,16.63 22.19,19.14 21.83,19.49 20.06,19.49 19.68,19.11 v19.68,19.06 | v37.62,9.61 38.73,8.5 2INAND1.3
  Bottom 0.152: v37.62,9.61 37.31,9.91 37.31,10.13 36.96,10.49 36.33,10.49 35.66,11.16 34.78,11.16 34.25,10.63 32.02,10.63 31.69,10.96 31.69,11.39 31.33,11.74 31.11,11.74 30.47,12.38 30.47,15.3 30.09,15.68 29.89,15.68 29.84,15.73 v24.75,15.73 | v19.68,19.06 19.5,18.89 18.2,18.89 17.9,18.58 17.46,18.58 17.14,18.25 v17.14,14.42
BASELINE_CNTRLR  (via drill 0.35)
  Top 0.152: v80,81.12 27.12,81.12 ARDUINO.26
  Bottom 0.152: BASELINE_CNTRLR.S 80,44.92 v80,81.12
BIT0  (via drill 0.35)
  Top 0.152: 2INOR1.1 9.52,27.78 10.78,29.05 19.04,29.05 19.68,29.68 | INV.1 19.68,28.41 | 19.68,28.41 19.68,29.68 | 19.68,29.68 19.68,65.24 ARDUINO.8 | 3INOR2.5 6.98,1.74 7.3,1.41 16.5,1.41 17.14,2.05 3INOR1.12 17.14,4.28 17.39,4.53 v17.77,4.53 | 19.68,28.41 v19.59,28.41 | v26.66,19.52 3INAND1.4 | v38.09,4.91 38.73,4.28 2INAND1.12 | v31.13,14.44 31.13,13.07 32.1,12.11 32.1,9.08 31.43,8.42 31.43,6.21 31.73,5.91 v31.73,3.65
  Bottom 0.152: 31.49,4.28 36.41,4.28 36.79,4.66 36.79,4.89 36.82,4.91 v38.09,4.91 | 31.49,4.28 28.21,4.28 27.35,5.15 26.38,5.15 26.28,5.04 24.98,5.04 24.22,4.28 18.41,4.28 18.15,4.53 v17.77,4.53 | v19.59,28.41 20.92,28.41 21.5,27.82 26.61,27.82 26.66,27.78 30.04,27.78 30.22,27.59 30.22,27.43 30.76,26.89 31.51,26.89 31.76,27.14 33.01,27.14 33.98,26.18 33.98,24.93 33.59,24.54 32.94,24.54 30.91,22.53 30.91,21.62 31.11,21.43 31.11,19.52 30.77,19.19 30.39,19.19 29.45,20.13 27.27,20.13 v26.66,19.52 27.93,18.25 31.54,18.25 33.62,16.17 33.62,15.46 33.26,15.1 31.77,15.1 31.13,14.46 v31.13,14.44 | v31.73,3.65 31.49,3.9 31.49,4.28
BIT0_  (via drill 0.35)
  Top 0.152: 3INOR2.8 9.52,9.36 10.15,9.99 v10.78,9.99 12.96,9.99 14.59,8.36 3INOR1.5 | INV.2 v18.41,28.41 | 4INOR1.5 13.96,16.91 v13.96,15.73 v11.33,15.73 3INOR3.8 | 3INAND1.8 22.21,13.23 22.21,13.8 v22.09,13.93 22.88,14.72 28.24,14.72 29.2,13.76 3INAND1.13 | v62.22,23.96 61.7,24.49 35.01,24.49 34.7,24.18 33.62,24.18 33.56,24.24 33.06,24.24 32.83,24.01 28.26,24.01 28.25,23.99 26,23.99 v25.5,24.49 | v63.49,15.71 v63.49,14.44 | v64.12,6.19 2INOR3.2
  Bottom 0.152: 20.31,18.89 20.31,22.7 21.61,23.99 21.61,24.24 21.96,24.59 22.47,24.59 22.57,24.49 v25.5,24.49 22.47,27.52 21.38,27.52 21.12,27.78 19.04,27.78 v18.41,28.41 | v62.22,23.96 63.49,22.7 63.49,21.84 63.16,21.51 63.16,16.91 63.46,16.61 63.46,15.74 v63.49,15.71 | v63.49,14.44 64.12,13.8 v64.12,6.19 | v11.33,15.73 12.03,15.73 12.69,15.08 12.69,11.42 11.26,9.99 v10.78,9.99 | v13.96,15.73 14.26,15.43 14.26,15.41 14.59,15.08 14.59,14.83 15.61,13.81 15.86,13.81 15.87,13.8 17.38,13.8 17.74,14.17 17.74,14.41 17.77,14.44 17.74,14.47 17.74,14.67 17.44,14.97 17.44,17.92 17.8,18.28 18.02,18.28 18.33,18.58 19.3,18.58 19.42,18.46 19.93,18.46 20.28,18.81 20.28,18.86 20.31,18.89 | 20.31,18.89 20.31,18.01 20.95,17.38 20.95,15.87 20.26,15.18 20.26,14.97 19.95,14.67 19.95,14.16 20.31,13.8 21.96,13.8 v22.09,13.93
BIT1  (via drill 0.35)
  Top 0.152: 3INOR2.13 3.91,8.77 3.91,9.1 5.44,10.63 v7.61,10.63 15.87,10.63 | 15.87,10.63 3INOR1.4 | 3INOR1.11 15.87,5.15 17.66,6.94 17.66,10.1 17.14,10.63 15.87,10.63 | v17.14,28.41 INV.3 17.88,25.8 17.88,25.58 18.02,25.45 20.07,25.45 20.2,25.58 20.2,28.66 19.98,28.88 19.98,65.11 21.52,66.65 22.68,66.65 23.81,67.78 ARDUINO.9 | v15.23,15.73 15.85,16.36 | 15.85,16.36 15.87,16.37 4INOR1.4 | 2INOR2.1 v52.7,9.99 | 3INAND1.3 v27.93,19.52 27.52,19.52 26.91,20.13 26.41,20.13 26.26,19.98 v25.58,19.98 | v21.58,16.98 21.14,16.98 20.2,16.03 16.18,16.03 15.85,16.36
  Bottom 0.152: v17.14,28.41 17.14,28.02 14.62,25.51 14.62,25.01 15.77,23.87 | 15.77,23.87 15.87,23.76 15.87,18.79 16.2,18.46 16.2,16.27 15.66,15.73 v15.23,15.73 | v52.7,9.99 52.06,10.63 43.6,10.63 43.27,10.96 39.87,10.96 39.56,11.27 39.36,11.27 32.07,18.55 28.26,18.55 27.93,18.89 v27.93,19.52 | v25.58,19.98 25.36,19.76 25.36,19.27 24.67,18.58 22.13,18.58 21.25,17.7 21.25,17.31 v21.58,16.98 | 15.77,23.87 15.62,23.73 15.62,23.5 15.27,23.15 14.23,23.15 13.19,22.11 12.76,22.11 11.16,20.51 10.94,20.51 10.15,19.72 10.15,18.84 9.77,18.46 9.52,18.46 9.26,18.46 8.45,18.46 6.34,16.35 6.34,11.27 6.98,10.63 v7.61,10.63
BIT1_  (via drill 0.35)
  Top 0.152: v5.07,24.6 3.8,24.6 3.16,23.96 2INOR1.9 3.16,21.17 2.56,20.57 v2.56,20.03 | v14.59,28.41 14.64,28.41 15.87,27.19 INV.4 16.61,25.8 16.61,25.58 17.05,25.15 v17.27,25.15 | v3.16,14.42 3INOR3.2 v3.16,10.63 | v3.16,4.91 3INOR2.2 | 2INOR2.6 v46.34,6.19 46.34,5.72 45.61,4.99 45.61,4.49 46.34,3.75 2INOR2.9 | v40.63,6.19 39.99,6.82 2INAND1.2 | v27.93,6.28 29.2,7.55 2INAND2.2 29.2,8.73 28.57,9.36 24.75,9.36 24.12,8.73 2INAND2.6 | v57.14,4.91 57.14,5.55 59.05,7.45 2INOR3.6 59.05,8.73 60.31,9.99 64.76,9.99 65.39,9.36 2INOR3.1 | v29.84,15.08 29.84,16.92 3INAND1.2 v29.2,19.52
  Bottom 0.152: v3.16,14.42 v3.15,14.43 2.76,14.43 2.15,15.05 1.92,15.05 1.7,15.27 1.7,19.26 2.47,20.03 v2.56,20.03 | v3.16,10.63 v3.16,4.91 | v57.14,4.91 56.76,5.3 48.5,5.3 47.62,6.19 v46.34,6.19 v40.63,6.19 40.6,6.16 39.11,6.16 38.78,5.83 35.81,5.83 35.2,5.22 28.99,5.22 v27.93,6.28 28.19,6.28 28.82,6.92 29.32,6.92 29.84,6.41 29.84,6.19 30.16,5.86 32.38,5.86 32.38,5.94 32.64,6.21 32.64,7.71 32.29,8.06 31.79,8.06 31.43,7.71 31.43,7.25 31.05,6.87 30.85,6.87 29.89,7.83 28.62,7.83 27.3,9.16 27.3,13.17 27.62,13.5 27.75,13.5 27.75,13.51 28.27,13.51 v29.84,15.08 | v17.27,25.15 17.23,25.19 17.23,27.68 17.35,27.8 17.39,27.8 17.74,28.16 17.74,28.41 17.8,28.47 17.8,28.66 18.15,29.02 20.74,29.02 21.63,28.13 30.12,28.13 30.53,27.72 30.53,27.55 30.88,27.2 31.39,27.2 31.69,27.5 33.29,27.5 34.28,26.51 34.28,24.68 33.84,24.24 33.06,24.24 32.71,23.88 32.71,23.72 31.74,22.75 31.58,22.75 31.22,22.4 31.22,21.9 31.52,21.59 31.52,19.3 31.11,18.89 29.84,18.89 v29.2,19.52 | v14.59,28.41 14.59,27.64 13.02,26.06 13.02,25.36 12.56,24.91 12.18,24.91 11.92,25.16 10.92,25.16 10.36,24.6 9.56,24.6 8.95,25.21 7.36,25.21 7,24.85 7,24.63 6.44,24.06 6.26,24.24 5.43,24.24 v5.07,24.6
BIT2  (via drill 0.35)
  Top 0.152: v15.23,25.26 15.23,25.91 INV.5 15.34,25.8 15.34,25.58 16.41,24.51 17.49,24.51 18.12,25.14 20.19,25.14 20.5,25.46 | 4INOR1.3 17.14,18.27 v16.5,19.01 | 20.5,25.46 20.95,25.9 v20.95,24.62 | 3INOR2.4 v5.7,4.91 v11.82,4.91 14.03,4.91 14.57,5.46 14.57,5.65 15.74,6.81 16.26,6.81 16.39,6.94 16.39,7.28 3INOR1.3 16.5,8.66 v16.5,9.99 | v4.44,6.19 3INOR2.12 | 2INOR2.8 43.09,1.09 34.04,1.09 v32.76,2.38 32.95,2.38 2INAND1.8 | ARDUINO.10 25.86,66.35 21.64,66.35 20.31,65.01 20.31,28.98 20.5,28.79 20.5,25.46
  Bottom 0.152: v5.7,4.91 v4.44,6.19 | 16.5,18.89 16.5,16.14 15.48,15.13 14.98,15.13 14.57,15.54 14.57,15.98 14.21,16.34 13.71,16.34 13.35,15.98 13.35,8.03 14.59,6.79 17.53,6.79 19.65,8.91 19.65,9.67 19.29,10.03 18.79,10.03 18.78,10.02 16.53,10.02 v16.5,9.99 | 16.5,18.89 v16.5,19.01 | v11.82,4.91 13.96,4.91 14.52,4.35 14.52,4.13 14.88,3.77 15.38,3.77 15.69,4.07 16.29,4.07 16.5,4.28 17.17,4.28 17.52,3.93 18.02,3.93 18.07,3.98 24.45,3.98 25.21,4.74 26.4,4.74 26.51,4.84 27.22,4.84 28.09,3.98 30.55,3.98 32.15,2.38 v32.76,2.38 | v15.23,25.26 15.23,24.83 16.17,23.89 16.17,19.21 16.5,18.89
BIT2_  (via drill 0.35)
  Top 0.152: v12.69,28.41 12.69,27.19 INV.6 | 2INOR1.2 8.24,27.84 v7.64,28.44 6.63,28.44 6.56,28.51 6.06,28.51 5.39,27.84 3.86,27.84 3.16,27.14 2INOR1.6 2.42,25.7 2.42,25.36 1.9,24.83 v1.9,24.6 | v1.9,14.44 3INOR3.1 1.9,9.63 2.42,9.1 2.42,6.94 1.9,6.42 3INOR2.1 1.9,2.38 3.16,1.11 17.77,1.11 18.41,1.74 3INOR1.13 19.15,2.34 19.15,2 19.28,1.86 21.7,1.86 22.21,2.38 22.21,4.41 23.48,4.41 | 2INAND2.5 24.64,7.29 24.64,6.93 23.51,5.8 23.51,4.44 23.48,4.41 | 2INAND2.1 29.72,7.29 29.72,6.96 v29.07,6.31 27.17,4.41 23.48,4.41 | 2INOR2.2 v51.42,6.19 2INOR2.13 51.42,2.38 52.7,1.11 62.49,1.11 63.38,2 63.38,2.34 2INOR3.13 | v42.51,6.82 41.3,8.03 2INAND1.1 | 2INAND1.6 34.91,6.84 34.61,6.53 34.61,6.52 v34.28,6.19
  Bottom 0.152: v7.64,28.44 12.66,28.44 v12.69,28.41 | v29.07,6.31 29.07,5.68 29.2,5.55 33.64,5.55 v34.28,6.19 38.71,6.19 38.98,6.46 40.05,6.46 40.38,6.79 40.88,6.79 41.18,6.49 42.18,6.49 | v51.42,6.19 50.84,5.6 48.83,5.6 47.94,6.49 46.9,6.49 46.6,6.79 46.09,6.79 45.79,6.49 42.18,6.49 | v1.9,24.6 1.4,24.1 1.4,14.94 v1.9,14.44 | 42.18,6.49 v42.51,6.82
BIT3  (via drill 0.35)
  Top 0.152: INV.8 12.8,20.63 12.8,20.41 13.19,20.02 14.03,20.02 14.08,19.97 16.83,19.97 17.97,18.83 17.97,17.98 4INOR1.2 | v16.5,29.68 19.04,29.68 19.37,30.01 19.37,65.37 21.09,67.08 21.09,68.25 21.75,68.91 28.71,68.91 ARDUINO.11 | v11.42,23.94 12.05,23.31 INV.8 | 3INOR2.3 5.07,3.71 5.07,5.55 5.7,6.19 3INOR2.11 v5.7,9.99 | v10.78,21.43 12.01,21.43 INV.8
  Bottom 0.152: v16.5,29.68 16.5,29.06 16.22,28.79 16.22,27.97 14.01,25.76 14.01,24.23 13.54,23.75 13.13,23.75 12.94,23.94 v11.43,23.94 v11.42,23.94 | v10.78,21.43 10.78,21.22 6.03,16.47 6.03,10.33 v5.7,9.99
BIT3_  (via drill 0.35)
  Top 0.152: 2INOR1.13 8.24,23.33 v8.68,23.76 6.77,23.76 5.18,25.36 5.18,25.7 2INOR1.5 3.69,25.7 3.69,25.36 1.9,23.56 2INOR1.8 | v12.69,23.33 12.69,22.02 INV.9 14.07,20.63 14.07,20.41 14.2,20.28 18.5,20.28 18.81,19.98 19.68,19.98 19.81,20.1 22.14,20.1 22.33,20.29 22.33,22.55 22.46,22.69 23.24,22.69 23.37,22.55 23.37,20.29 23.76,19.9 23.76,19.51 24.64,18.63 24.64,18.3 3INAND1.5 25.39,16.35 26.3,15.43 28.53,15.43 29.52,14.44 30.47,14.44 30.47,15.96 | 2INAND1.13 39.25,3.81 v39.25,4.62 36.19,7.68 | 36.19,7.68 2INAND1.5 35.44,8.78 35.44,9.1 33,11.54 33,13.42 30.47,15.96 | 2INAND1.9 34.91,6.41 36.19,7.68 | 30.47,15.96 3INAND1.1 | 2INOR2.5 47.23,7.64 v47.23,5.45 48.42,5.45 50.16,3.71 2INOR2.12 | 2INOR3.5 v60.31,6.19 60.94,6.19 62.11,5.01 62.11,3.82 2INOR3.12
  Bottom 0.152: v60.31,6.19 59.68,6.19 57.8,4.31 56.89,4.31 56.53,4.66 56.53,4.89 56.51,4.91 47.77,4.91 v47.23,5.45 47.1,5.58 46.09,5.58 46.04,5.63 45.79,5.88 41.18,5.88 40.88,5.58 40.66,5.58 40.63,5.55 39.99,5.55 39.97,5.52 39.97,5.3 39.61,4.94 39.58,4.94 v39.25,4.62 | v8.68,23.76 8.68,23.34 8.99,23.03 12.39,23.03 v12.69,23.33
BYPASS_CNTRL
  Top 0.152: BYPASS.P$2 78.48,51.16 R2.1 76.19,65.88 75.41,66.65 31.91,66.65 30.96,67.59 30.96,68.25 30,69.21 21.62,69.21 20.19,67.78 ARDUINO.7
C  (via drill 0.35)
  Top 0.152: 3INOR1.9 12.58,2.34 12.58,2 12.45,1.86 11.66,1.86 11.51,2.02 v11.23,2.02 | v86.35,19.52 MUXC/D.13
  Bottom 0.152: v11.23,2.02 12.14,1.11 81.91,1.11 86.35,5.55 v86.35,19.52
C1  (via drill 0.35)
  Top 0.152: 3INOR1.1 v19.68,6.19 | v36.19,4.91 2INAND1.10
  Bottom 0.152: v36.19,4.91 35.86,4.59 28.34,4.59 26.67,6.26 25.77,6.26 25.47,5.95 24.5,5.95 22.69,5.95 22.49,6.16 21.99,6.16 21.63,5.8 21.63,5.6 21.58,5.55 20.31,5.55 v19.68,6.19
C2  (via drill 0.35)
  Top 0.152: 3INOR1.2 v18.41,6.19 | v22.24,5.55 21.94,5.25 21.94,4.83 21.47,4.37 v21.47,2.49 | 2INAND1.11 36.71,2.32 36.71,2 36.57,1.86 34.53,1.86 34.17,2.22 34.17,4.14 34.03,4.27 33.26,4.27 33.12,4.14 33.12,3.95 v31.3,2.12
  Bottom 0.152: v21.47,2.49 21.83,2.12 v31.3,2.12 | v22.24,5.55 21.91,5.22 18.94,5.22 18.41,5.76 v18.41,6.19
C3  (via drill 0.35)
  Top 0.152: 3INOR1.8 12.8,3.82 12.8,4.16 13.25,4.61 14.15,4.61 15.02,5.47 v15.26,5.47 | v24.12,5.04 25.4,6.83 25.78,6.83 25.91,6.96 25.91,7.29 2INAND2.4
  Bottom 0.152: v24.12,5.04 23.66,4.59 18.72,4.59 17.75,5.55 15.33,5.55 v15.26,5.47
COL  (via drill 0.35)
  Top 0.152: MUXE/F.4 61.59,13.17 62.25,13.83 63.74,13.83 64.1,14.19 64.1,15.03 v64.76,15.7 | v64.76,49.37 v57.14,49.37
  Bottom 0.152: v64.76,49.37 64.76,31.07 65.1,30.73 65.1,29.92 64.81,29.63 64.81,27.41 64.73,27.34 64.73,20.54 64.38,20.18 63.95,20.18 63.8,20.03 63.8,17.31 64.15,16.96 64.38,16.96 64.76,16.58 v64.76,15.7 | v57.14,49.37 56.51,50 LCD.P$28
D  (via drill 0.35)
  Top 0.152: 4INAND1.1 34.28,13.23 v34.28,14.16 | v46.75,10.02 47.18,10.02 47.76,10.6 53.65,10.6 v55.16,9.09 | v56.62,7.57 56.51,7.45 56.51,2.31 v57.11,1.71 | v85.08,13.8 MUXC/D.3
  Bottom 0.152: v34.28,14.16 36.03,14.16 39.23,10.96 39.44,10.96 39.74,10.66 43.14,10.66 43.48,10.33 46.45,10.33 v46.75,10.02 | v55.16,9.09 56.62,7.63 v56.62,7.57 | v57.11,1.71 57.41,1.41 81.78,1.41 85.08,4.71 v85.08,13.8
D1  (via drill 0.35)
  Top 0.152: 3INOR1.6 12.82,7.52 v12.82,6.19 | v35.15,10.24 34.91,10.48 4INAND1.2 | v25.4,10.38 v30.45,10.38
  Bottom 0.152: v12.82,6.19 14.39,6.19 14.66,6.46 17.64,6.46 22.02,10.85 24.93,10.85 v25.4,10.38 | v30.45,10.38 31.36,10.38 31.71,10.02 34.93,10.02 v35.15,10.24
D2  (via drill 0.35)
  Top 0.152: v16.5,4.91 16.91,4.91 17.52,5.52 20.28,5.52 21.06,6.3 21.06,7.02 20.92,7.15 v20.92,8.73 | v24.12,9.99 24.93,9.99 25.15,9.77 31.03,9.77 v31.08,9.72 | v35.8,9.6 35.8,12.2 4INAND1.3 | v15.18,4.53 15.18,3.66 3INOR1.10
  Bottom 0.152: v31.08,9.72 34.82,9.72 34.9,9.64 35.76,9.64 v35.8,9.6 | v20.92,8.73 20.92,9.32 22.15,10.54 23.57,10.54 v24.12,9.99 | v16.5,4.91 16.12,4.53 v15.18,4.53
D3  (via drill 0.35)
  Top 0.152: 2INOR1.11 5.7,23.15 v5.88,23.33 | v39.36,14.44 38.67,14.44 37.45,13.23 4INAND1.4
  Bottom 0.152: v5.88,23.33 8.25,23.33 8.86,22.72 12.94,22.72 14.32,24.1 14.32,25.64 16.53,27.85 16.53,28.66 16.88,29.02 17.72,29.02 18.03,29.32 20.87,29.32 21.76,28.43 31.11,28.43 31.13,28.41 31.39,28.41 31.69,28.11 33.95,28.11 34.93,27.12 34.93,23.12 34.53,22.72 33.67,22.72 33.64,22.7 33.01,22.7 32.74,22.42 32.74,21.83 33.34,21.22 33.34,20.79 34.92,19.22 34.92,18.89 35.14,18.66 35.53,18.66 39.36,14.83 v39.36,14.44
D3A  (via drill 0.35)
  Top 0.152: 2INOR1.12 v6.98,19.54 | 2INAND2.3 27.18,7.29 27.18,6.96 26.02,5.8 v26.02,5.65
  Bottom 0.152: v6.98,19.54 5.07,17.64 5.07,9.99 5.1,9.97 5.1,9.74 5.46,9.38 5.47,9.39 5.96,9.39 6.56,9.99 7.39,9.99 8.02,9.36 9.01,9.36 10.3,8.06 10.3,6.44 10.48,6.26 11.34,6.26 12.38,5.22 14.33,5.22 14.65,5.54 14.65,5.73 15.01,6.08 15.51,6.08 15.73,5.86 17.88,5.86 18.82,4.91 23.07,4.91 23.81,5.65 24.37,5.65 v26.02,5.65
D4  (via drill 0.35)
  Top 0.152: 3INOR2.9 v8.24,9.98 v8.25,9.99 | v10.72,11.27 11.05,10.94 17.69,10.94 v17.99,10.63 | v26.02,11.14 v31.08,11.14 | 4INAND1.5 38.73,11.27 38.57,11.11 38.47,11.11 38.12,10.75 38.12,10.66 37.68,10.22 37.37,10.22 37.03,9.88 v36.71,9.88
  Bottom 0.152: v26.02,11.14 25.9,11.27 25.79,11.15 21.69,11.15 20.56,10.02 20.06,10.02 19.75,10.33 18.29,10.33 v17.99,10.63 | v31.08,11.14 31.74,10.48 31.74,10.43 31.84,10.33 34.38,10.33 34.9,10.85 35.41,10.85 36.37,9.88 v36.71,9.88 | v8.25,9.99 8.55,9.69 8.99,9.69 9.01,9.66 9.52,9.66 10.72,10.87 v10.72,11.27
DP2  (via drill 0.35)
  Top 0.152: MUXA/B.11 76.83,23.96 75.53,25.26 66.41,25.26 65.81,25.87 v60.31,25.87 | v60.31,34.76 59.68,35.4 54.6,35.4 v53.97,34.76
  Bottom 0.152: v53.97,34.76 53.33,34.12 53.33,30.96 LCD.P$12 | v60.31,34.76 60.02,34.47 60.02,29.92 59.68,29.58 59.68,29.27 60.29,28.66 60.29,28.16 59.9,27.78 58.41,27.78 58.41,26.51 58.91,26.01 59.02,26.01 59.16,25.87 v60.31,25.87
DP3  (via drill 0.35)
  Top 0.152: MUXG.11 v51.42,20.16 | v51.42,27.14 52.06,27.78 v63.49,27.78
  Bottom 0.152: v51.42,20.16 v51.42,27.14 | v63.49,27.78 64.12,28.41 LCD.P$16
E  (via drill 0.35)
  Top 0.152: 3INAND1.10 v25.39,14.11 | v33.01,15.71 41.86,15.71 v41.88,15.73 | v60.95,15.71 61.59,16.35 MUXE/F.13
  Bottom 0.152: v33.01,15.71 30.49,15.71 30.16,16.04 25.31,16.04 25.01,16.34 24.5,16.34 24.15,15.98 24.15,15.48 25.39,14.24 v25.39,14.11 | v41.88,15.73 41.93,15.68 42.76,15.68 43.07,15.38 60.62,15.38 v60.95,15.71
E1  (via drill 0.35)
  Top 0.152: 3INAND1.11 v26.66,14.11 | v32.04,6.46 32.98,6.46 v33.25,6.19 | v50.16,6.21 2INOR2.3
  Bottom 0.152: v26.66,14.11 26.66,8.73 28.16,7.22 29.45,7.22 30.14,6.53 30.14,6.52 30.47,6.19 31.76,6.19 v32.04,6.46 | v33.25,6.19 33.89,6.82 34.28,6.82 34.31,6.79 34.53,6.79 34.83,6.49 38.58,6.49 38.86,6.77 39.92,6.77 40.25,7.1 41.01,7.1 41.27,6.83 41.66,6.83 42.26,7.43 42.76,7.43 43.37,6.82 45.69,6.82 45.97,7.1 46.72,7.1 47.02,6.8 48.06,6.8 48.65,6.21 v50.16,6.21
E2  (via drill 0.35)
  Top 0.152: 3INAND1.12 v27.93,14.11 | v32.04,7.45 32.82,8.24 v32.82,9.11 | v48.88,9.99 2INOR2.4
  Bottom 0.152: v48.88,9.99 47.88,8.99 47.34,8.99 47.23,9.11 46.37,9.11 45.77,9.72 43.22,9.72 42.94,9.99 39.79,9.99 38.79,8.99 35.55,8.99 35.21,9.33 34.78,9.33 34.75,9.36 33.07,9.36 v32.82,9.11 | v27.93,14.11 27.62,13.8 27.21,13.8 26.96,13.56 26.96,9.05 28.49,7.53 29.76,7.53 30.8,6.49 31.11,6.49 32.04,7.42 v32.04,7.45
F  (via drill 0.35)
  Top 0.152: 4INAND2.13 29.95,20.74 29.95,20.41 33.12,17.24 33.12,16.49 33.26,16.35 41.65,16.35 41.69,16.38 v42.51,16.38 | v55.16,9.99 55.16,13.24 52.67,15.74 48.63,15.74 48.03,16.35 v47.98,16.35 | v59.05,9.99 60.31,11.27 MUXE/F.3
  Bottom 0.152: v42.51,16.38 42.55,16.35 v47.98,16.35 | v55.16,9.99 v59.05,9.99
F1  (via drill 0.35)
  Top 0.152: 3INOR2.6 8.99,3.82 8.99,4.16 9.12,4.29 9.91,4.29 9.92,4.28 v10.78,4.28 | v11.23,18.47 11.37,18.47 12.52,19.62 16.75,19.62 17.66,18.71 17.66,16.45 17.89,16.45 18.01,16.34 20.07,16.34 21.58,17.85 v21.58,18.89 | v24.75,19.52 24.12,20.16 4INAND2.9 | v10.78,9.09 10.78,7.69 10.03,6.94 9.91,6.81 9.89,6.79 9.26,6.79 8.91,6.44 8.91,5.93 9.62,5.22 10.45,5.22 v10.78,5.55
  Bottom 0.152: v10.78,4.28 v10.78,5.55 | v21.58,18.89 24.12,18.89 v24.75,19.52 | v11.23,18.47 13.05,16.64 13.05,11.35 v10.78,9.09
F2  (via drill 0.35)
  Top 0.152: 4INAND2.10 26.14,22.23 26.14,22.55 26.28,22.7 28.39,22.7 28.68,22.99 30.99,22.99 31.3,22.68 v31.83,22.15 | v43.83,11.27 43.83,2.69 v43.66,2.52 | v46.22,4.74 46.67,4.29 46.74,4.29 47.62,3.41 2INOR2.10
  Bottom 0.152: v31.83,22.15 31.83,19.23 39.49,11.57 39.69,11.57 39.99,11.27 v43.83,11.27 | v43.66,2.52 44.15,2.52 v46.22,4.74
F3  (via drill 0.35)
  Top 0.152: 4INAND2.11 27.41,20.74 27.41,20.41 27.69,20.13 29.45,20.13 29.81,19.77 29.81,18.91 29.96,18.76 30.86,18.76 31.13,18.49 31.13,15.89 32.25,14.77 35.6,14.77 36.93,13.44 36.93,11.52 37.07,11.39 37.15,11.39 v37.45,11.09 | v47.62,9.6 47.98,9.24 48.01,9.24 48.36,8.89 48.36,6.48 50.68,4.16 50.68,2 50.55,1.86 49.76,1.86 49.63,2 49.63,2.34 2INOR2.11
  Bottom 0.152: v47.62,9.6 47.19,9.6 47,9.42 46.5,9.42 45.9,10.02 43.35,10.02 43.07,10.3 39.66,10.3 38.73,9.36 37.87,10.22 37.62,10.22 37.62,10.26 37.45,10.43 v37.45,11.09
F4  (via drill 0.35)
  Top 0.152: 4INAND2.12 28.68,22.23 28.68,22.55 28.81,22.69 30.86,22.69 30.99,22.55 30.99,21.54 31.69,20.84 v32.43,20.84 | v58.3,5.66 59.98,5.66 60.06,5.58 60.69,5.58 v61.15,5.12 | v62.86,4.91 2INOR3.3
  Bottom 0.152: v58.3,5.66 57.66,5.66 53.3,10.02 53.3,10.25 49.11,14.44 40.22,14.44 39.61,13.83 39.11,13.83 38.75,14.19 38.75,15.01 35.41,18.35 34.06,18.35 33.7,18.71 33.7,19.57 v32.43,20.84 | v61.15,5.12 62.65,5.12 v62.86,4.91
G  (via drill 0.35)
  Top 0.152: v48.88,16.35 MUXG.13 | 4INAND2.1 31.08,25.84 31.21,25.71 31.51,25.4 48.28,25.4 v48.88,26.01
  Bottom 0.152: v48.88,26.01 v48.88,16.35
G1  (via drill 0.35)
  Top 0.152: 3INOR2.10 v6.98,6.19 | v22.44,30.54 23.93,29.05 27.3,29.05 29.2,27.14 4INAND2.2
  Bottom 0.152: v6.98,6.19 6.31,5.52 6.31,4.66 5.93,4.28 2.53,4.28 1.09,5.72 1.09,24.66 4.26,27.82 4.85,28.41 4.95,28.51 6.56,28.51 6.66,28.41 6.75,28.41 7.39,29.05 7.48,29.05 7.89,29.05 8.2,28.75 12.17,28.75 12.44,29.02 12.66,29.02 12.69,29.05 13.5,29.05 13.81,29.35 14.52,29.35 14.98,29.81 14.98,30.31 15.9,31.23 17.1,31.23 17.71,30.62 21.29,30.62 21.38,30.54 v22.44,30.54
G2  (via drill 0.35)
  Top 0.152: 4INAND2.3 28.68,25.7 28.68,25.38 28.95,25.1 58.47,25.1 v58.77,25.4 | v60.31,16.35 v60.31,14.44 | 2INOR3.11 61.59,3.83 60.73,4.68 v59.46,4.68
  Bottom 0.152: v59.46,4.68 59.67,4.68 60.92,5.93 60.92,13.83 v60.31,14.44 | v60.31,16.35 59.9,16.35 59.3,16.95 58.87,16.95 58.41,17.41 58.41,25.04 v58.77,25.4
G3  (via drill 0.35)
  Top 0.152: 4INAND2.4 27.3,25.81 27.3,25.23 27.74,24.79 59.38,24.79 v59.68,25.1 | v62.22,15.71 v62.22,14.44 | v62.22,6.19 61.59,6.82 2INOR3.4
  Bottom 0.152: v62.22,14.44 v62.22,6.19 | v62.22,15.71 62.22,16.58 62.55,16.91 62.55,21.51 62.25,21.81 62.25,22.53 v59.68,25.1
G4  (via drill 0.35)
  Top 0.152: 3INOR3.9 8.99,18.29 8.99,18.63 9.12,18.76 9.21,18.76 v9.52,19.06 | 4INAND2.5 25.39,25.23 24.14,23.99 23.07,23.99 22.46,24.6 21.78,24.6 21.2,24.02 20.26,24.02 19.68,24.6 18.01,24.6 17.62,24.2 15.47,24.2 v15.02,23.75
  Bottom 0.152: v15.02,23.75 14.4,23.75 13.07,22.42 12.64,22.42 11.04,20.82 10.81,20.82 9.52,19.52 v9.52,19.06
GND  (via drill 0.35)
  other vias: 55.87,25.87 41.27,21.43 41.9,19.52 55.23,2.38 53.97,4.28 54.6,6.82 32.38,26.51 46.98,37.94 56.51,11.27 44.44,13.8 59.68,22.7 66.66,22.7 69.2,22.7 42.03,9.36 10.78,12.54 21.58,26.51 14.59,9.99 22.85,9.87 22.85,19.52 9.52,6.19 11.42,19.52 4.44,10.63 10.78,27.14 10.78,3.01 7.86,5.55 19.04,23.23 21.58,12.54 32.38,13.17 52.06,14.44 44.06,17.62 11.22,7.07 38.73,10.5
  pour Top: -0.01,89.37 0.62,90 112.39,90 113.02,89.37 113.02,0.47 112.39,-0.16 0.62,-0.16 -0.01,0.47
  pour Bottom: -0.01,89.37 0.62,90 112.39,90 113.02,89.37 113.02,0.47 112.39,-0.16 0.62,-0.16 -0.01,0.47
K  (via drill 0.35)
  Top 0.152: MUXE/F.11 v64.13,16.35 | v33.31,23.63 33.67,23.27 33.67,23.08 34.34,22.42 54.01,22.42 55.97,20.46 63.54,20.46 v63.87,20.79 | v31.13,27.8 31.13,30.3 LCD.P$3
  Bottom 0.152: v31.13,27.8 33.62,27.8 34.63,26.79 34.63,24.6 33.66,23.63 v33.31,23.63 | v64.13,16.35 64.13,16.37 63.49,17.01 63.49,20.03 63.49,20.16 63.87,20.54 v63.87,20.79
MAXCLK
  Top 0.152: THERMOCOUPLE.5 8.24,62.53 8.6,62.89 8.6,66.87 ARDUINO.3
MAXCS
  Top 0.152: THERMOCOUPLE.6 6.98,62.27 7.89,63.19 7.89,66.87 ARDUINO.2
MAXSO
  Top 0.152: THERMOCOUPLE.7 4.96,62.11 4.96,62.44 4.44,62.97 ARDUINO.1
N$1
  Top 0.254: DIODE.2 64.04,86.83 64.81,87.6 69.07,87.6 TRANSFORMER.P$16
N$2
  Top 0.152: R1.2 92.18,49.5 BYPASS.P$3 87.78,51.19 84.79,51.19 79.66,46.06 R2.2
OVER  (via drill 0.35)
  Top 0.152: MUXC/D.4 86.35,16.98 v85.72,17.62 | v84.44,36.03 v34.28,36.03
  Bottom 0.152: v85.72,17.62 85.72,22.47 84.47,23.71 84.47,24.22 84.78,24.52 84.78,31.67 84.47,31.97 84.47,36 v84.44,36.03 | v34.28,36.03 33.64,36.66 LCD.P$37
RELAY  (via drill 0.35)
  Top 0.152: v78.09,69.05 66.67,69.05 65.96,69.77 14.04,69.77 ARDUINO.4
  Bottom 0.152: v78.09,69.05 78.09,27.36 77.49,26.76 77.49,12.51 SSR.P$3
SEL0  (via drill 0.35)
  Top 0.152: MUXG.10 v52.7,20.16 | v52.7,26.51 53.33,27.14 v65.39,27.14 77.46,27.14 v78.09,26.51 89.53,26.51 v90.16,25.87 | v78.09,23.96 MUXA/B.10 | MUXC/D.10 v90.16,23.96 | MUXE/F.10 v65.39,16.35 | v52.7,42.38 v33.01,42.38
  Bottom 0.152: v52.7,20.16 v52.7,26.51 52.7,29.78 52.68,29.79 52.68,34.77 52.7,34.78 v52.7,42.38 | v78.09,26.51 v78.09,23.96 | v90.16,23.96 v90.16,25.87 | ARDUINO.12 32.67,67.49 32.67,62.92 32.95,62.64 33.01,62.58 33.34,62.25 33.34,42.71 v33.01,42.38 | v65.39,27.14 65.04,26.78 65.04,20.41 64.14,19.52 64.12,19.52 64.12,17.62 64.48,17.26 64.51,17.26 65.06,16.71 65.06,16.68 v65.39,16.35
SEL1  (via drill 0.35)
  Top 0.152: MUXG.9 v53.97,20.16 | v53.97,26.01 54.46,26.51 66.03,26.51 v66.66,25.87 78.73,25.87 v79.36,25.23 90.8,25.23 91.43,24.6 MUXC/D.9 | v66.66,16.35 MUXE/F.9 | v79.36,23.96 MUXA/B.9 | v53.97,40.48 v35.55,40.48
  Bottom 0.152: v53.97,20.16 v53.97,26.01 53.97,28.94 52.99,29.92 52.99,34.64 53.97,35.62 v53.97,40.48 | v79.36,25.23 v79.36,23.96 | v35.55,40.48 34.91,41.11 ARDUINO.13 | v66.66,16.35 66.31,16.7 66.31,16.72 65.77,17.26 65.55,17.26 64.76,18.05 64.76,19.27 65.65,20.16 65.65,24.85 v66.66,25.87
T+
  Top 0.152: THERMO.P$1 13.96,42.79 15.46,44.3 15.46,45.54 14.18,46.83 12.49,46.83 6.01,53.3 6.01,54.75 6.98,55.72 THERMOCOUPLE.3
T-
  Top 0.152: THERMO.P$6 5.7,53.17 THERMOCOUPLE.2
VAC(L)
  Top 2.769: R4.1 105.4,58.89 AC(L)_IN.P$1
VAC(N)
  Top 2.769: R6.1 109.21,67.5 110.44,68.72 110.44,78.62 AC(N)_IN.P$1
VIN
  Top 0.254: ARDUINO.32 9.52,84.74 DIODE.1
X  (via drill 0.35)
  Top 0.152: MUXA/B.4 v74.28,13.8 | v67.94,43.02 67.3,43.65 29.2,43.65 v28.57,44.29
  Bottom 0.152: v74.28,13.8 72.38,15.71 69.2,15.71 67.92,16.99 67.92,30.86 67.94,30.87 v67.94,43.02 | v28.57,44.29 LCD.P$39
Y  (via drill 0.35)
  Top 0.152: MUXC/D.11 v88.89,23.96 | v88.89,34.12 29.84,34.12 28.57,32.86 LCD.P$2
  Bottom 0.152: v88.89,23.96 v88.89,34.12

### Text on the board
bNames: 2/4/20